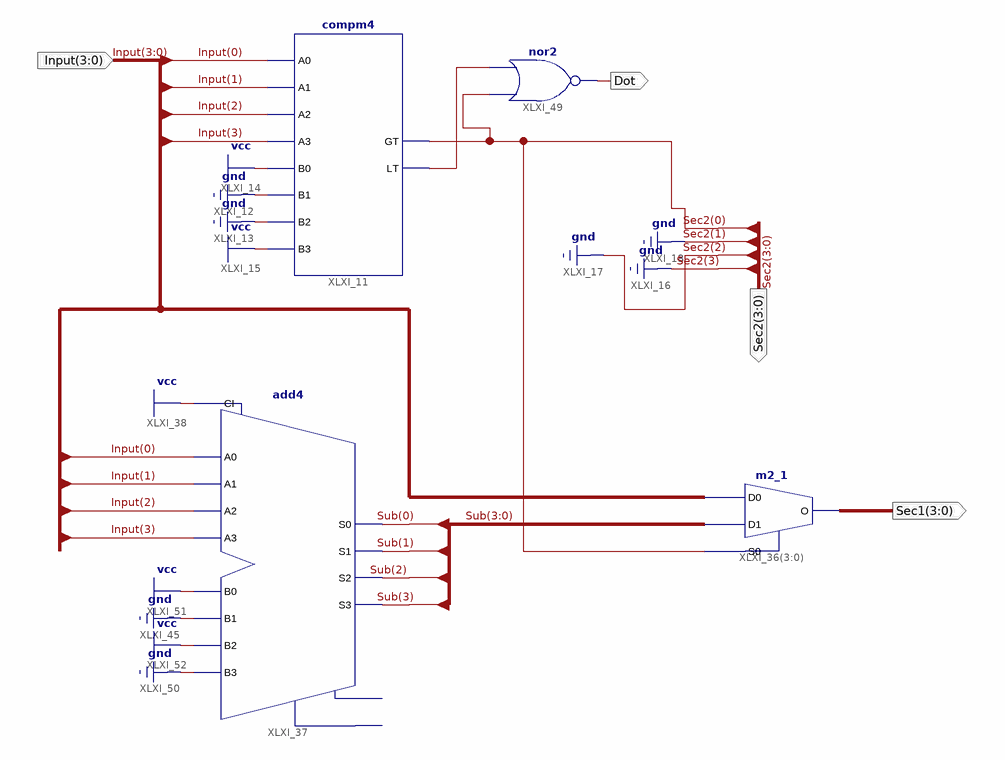
[diagram p0: schematic sheet 1]
// Xilinx ISE schematic binToBCD4Bit.sch (spartan6) as structural Verilog: 4 symbols, 4 ports
module binToBCD4Bit (
  input  [3:0] Input,
  output [3:0] Sec2,
  output [3:0] Sec1,
  output Dot
);

  wire XLXN_81;
  wire [3:0] Sub;

  compm4 XLXI_11 (
    .A0(Input[0]), .A1(Input[1]), .A2(Input[2]), .A3(Input[3]), .B0(1'b1), .B1(1'b0), .B2(1'b0), .B3(1'b1),
    .GT(Sec2[0]), .LT(XLXN_81));
  m2_1 XLXI_36[3:0] (.D0(Input), .D1(Sub), .S0(Sec2[0]), .O(Sec1));
  add4 XLXI_37 (
    .A0(Input[0]), .A1(Input[1]), .A2(Input[2]), .A3(Input[3]), .B0(1'b1), .B1(1'b0), .B2(1'b1), .B3(1'b0),
    .CI(1'b1), .S0(Sub[0]), .S1(Sub[1]), .S2(Sub[2]), .S3(Sub[3]));  // open: CO, OFL
  nor XLXI_49 (Dot, Sec2[0], XLXN_81);

  assign Sec2[3:1] = 3'b000;
endmodule
